# EAGLE design 4robots_MAIN_1_1 (EAGLE 9.5.0)
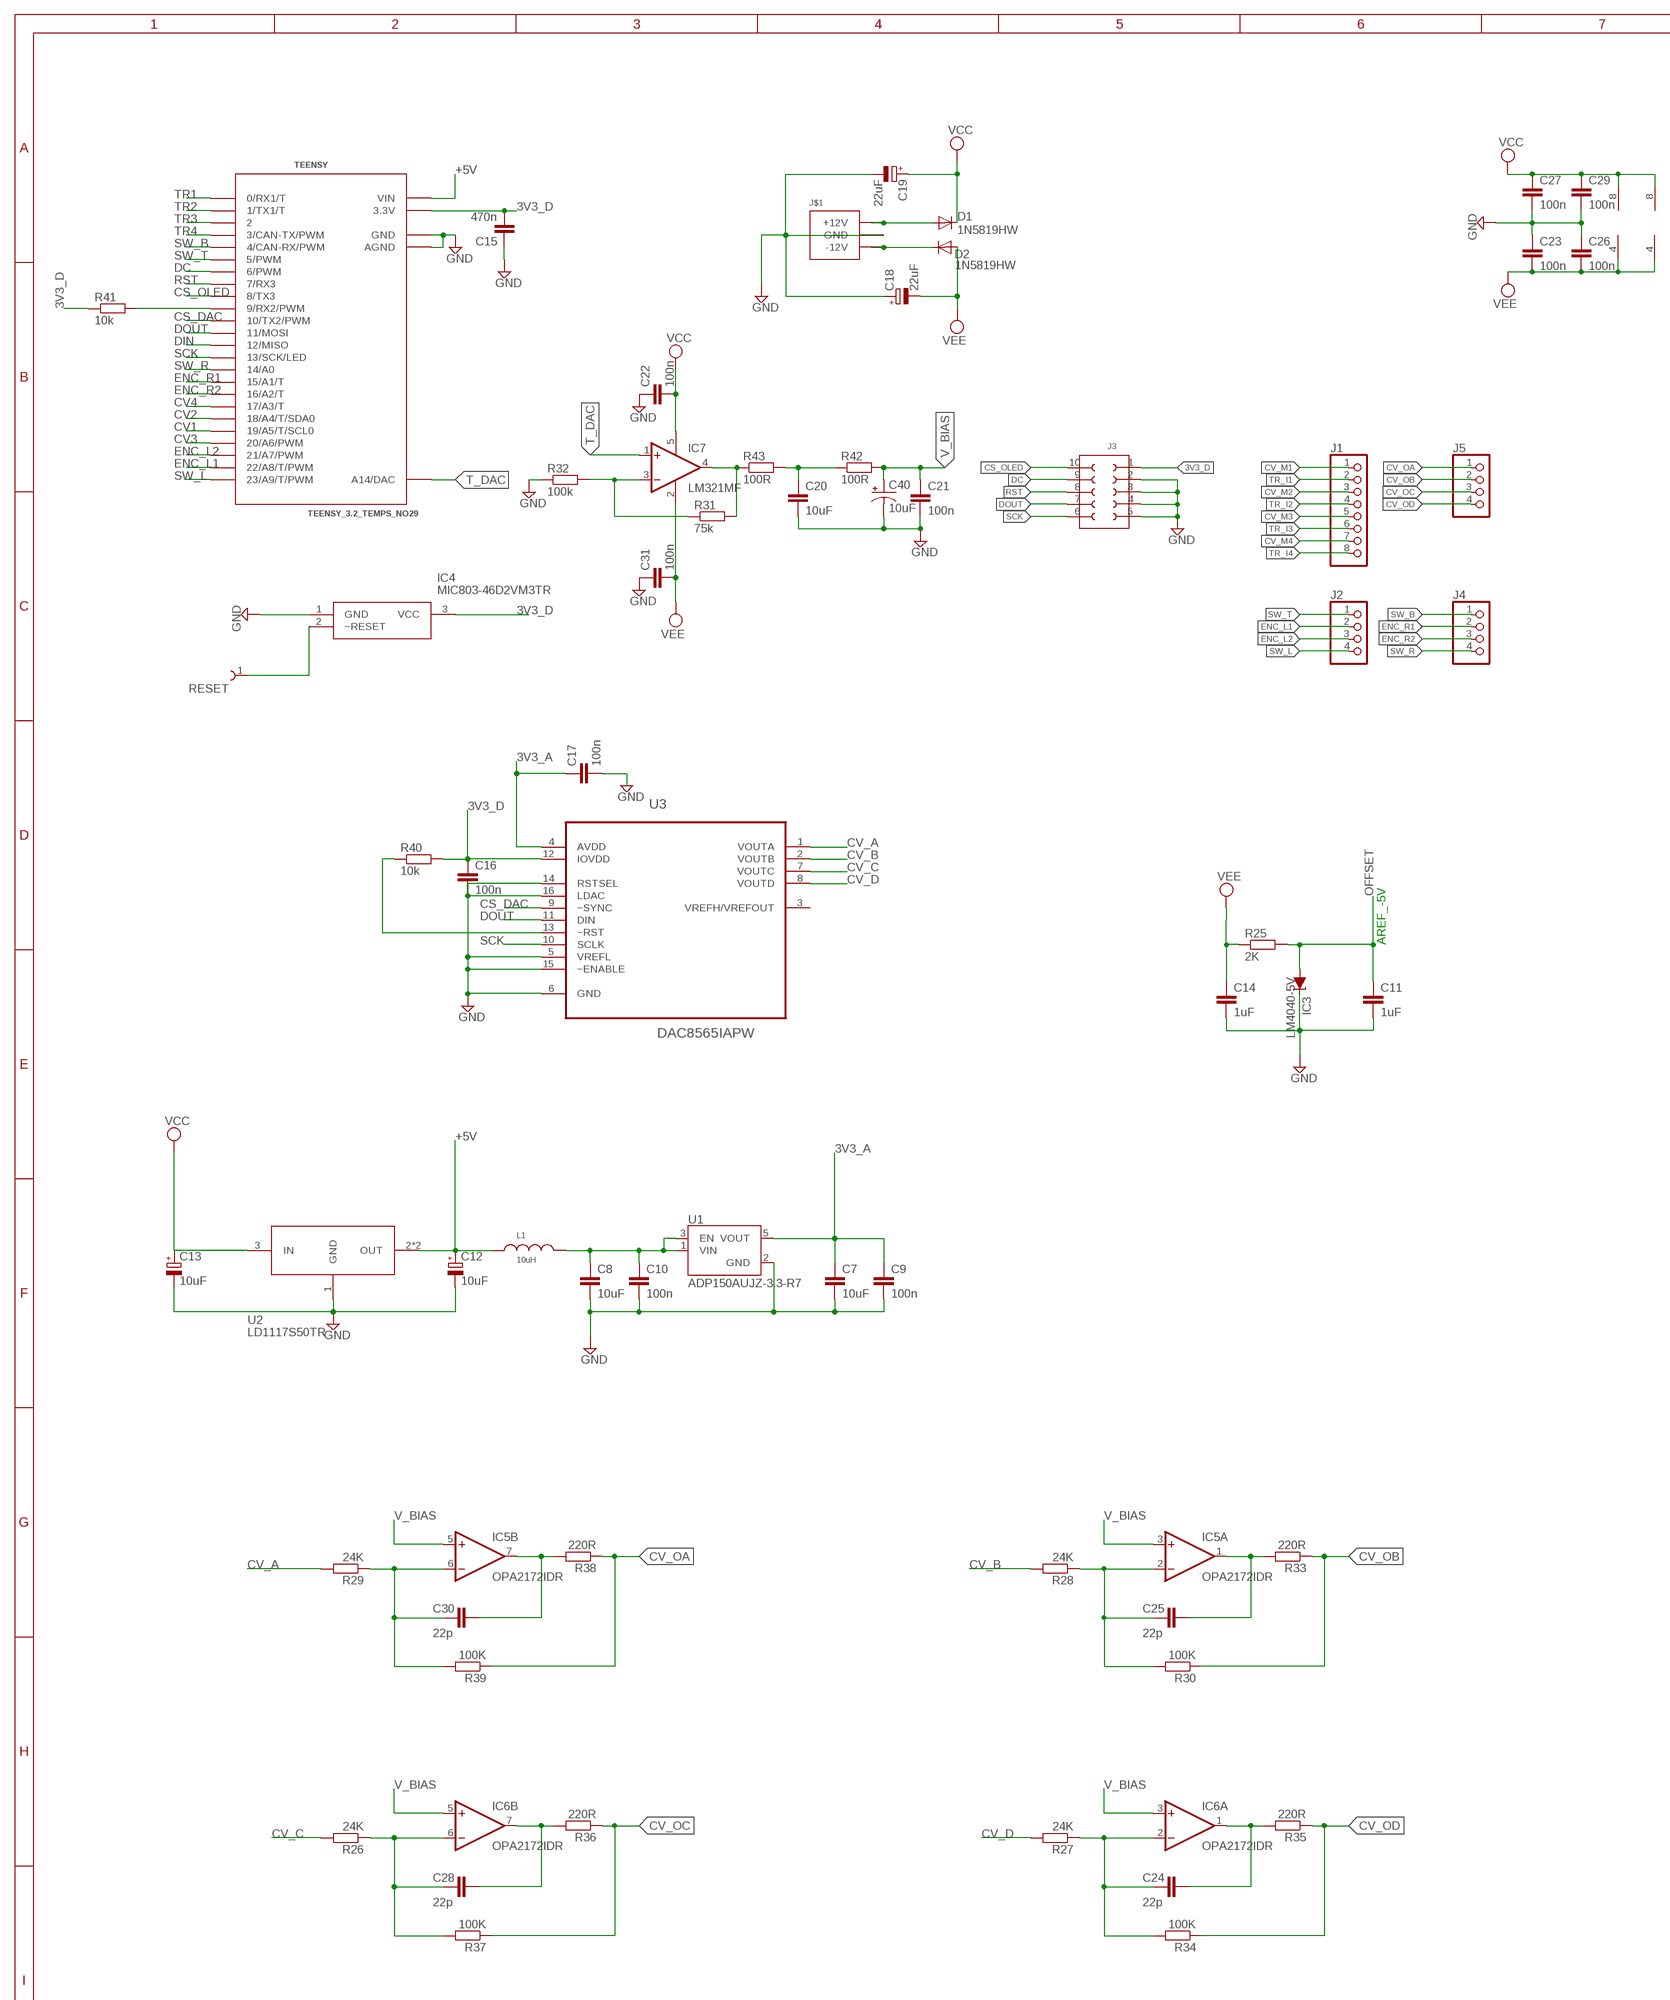
[diagram p0: schematic, sheet 1, part 1 of 2]
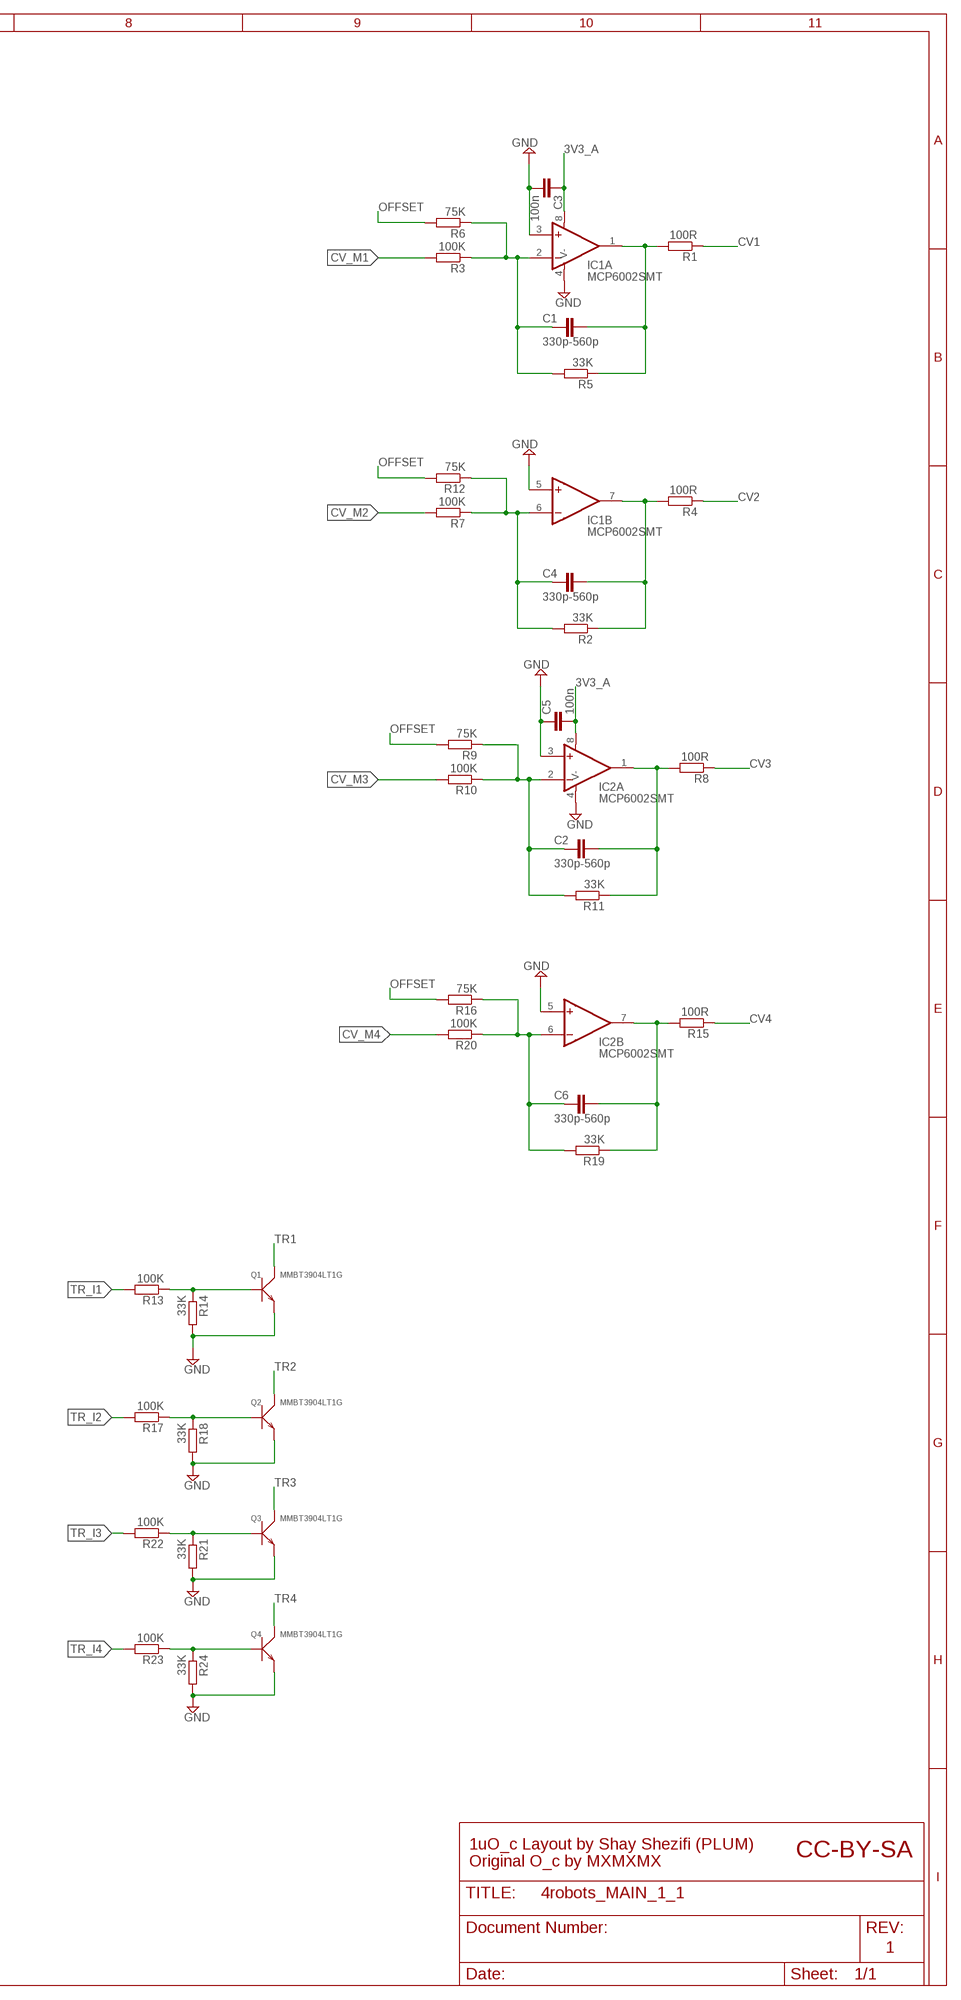
[diagram p1: schematic, sheet 1, part 2 of 2]

## Parts
C1  330p-560p  C-EUC0603  [C0603]
C2  330p-560p  C-EUC0603  [C0603]
C3  100n  C-EUC0603  [C0603]
C4  330p-560p  C-EUC0603  [C0603]
C5  100n  C-EUC0603  [C0603]
C6  330p-560p  C-EUC0603  [C0603]
C7  10uF  C-EUC1206K  [C1206K]
C8  10uF  C-EUC1206K  [C1206K]
C9  100n  C-EUC0603  [C0603]
C10  100n  C-EUC0603  [C0603]
C11  1uF  C-EUC0603  [C0603]
C12  10uF  CPOL-EUB  [PANASONIC_B]
C13  10uF  CPOL-EUB  [PANASONIC_B]
C14  1uF  C-EUC0603  [C0603]
C15  470n  C-EUC0603  [C0603]
C16  100n  C-EUC0603  [C0603]
C17  100n  C-EUC0603  [C0603]
C18  22uF  CPOL-EUC  [PANASONIC_C]
C19  22uF  CPOL-EUC  [PANASONIC_C]
C20  10uF  C-EUC0603  [C0603]
C21  100n  C-EUC0603  [C0603]
C22  100n  C-EUC0603  [C0603]
C23  100n  C-EUC0603  [C0603]
C24  22p  C-EUC0603  [C0603]
C25  22p  C-EUC0603  [C0603]
C26  100n  C-EUC0603  [C0603]
C27  100n  C-EUC0603  [C0603]
C28  22p  C-EUC0603  [C0603]
C29  100n  C-EUC0603  [C0603]
C30  22p  C-EUC0603  [C0603]
C31  100n  C-EUC0603  [C0603]
C40  10uF  CPOL-USA  [PANASONIC_A]
D1  1N5819HW  DIODE_DIODE-SOD123  [DIODE_SOD123]
D2  1N5819HW  DIODE_DIODE-SOD123  [DIODE_SOD123]
IC1  MCP6002SMT  [SOIC8]
IC2  MCP6002SMT  [SOIC8]
IC3  LM4040-5V  LM4041B12DBZ  [DBZ_R-PDSO-G3]
IC4  MIC803-46D2VM3TR  [SOT95P230X110-3N]
IC5  OPA2172IDR  TL072D  [SO08]
IC6  OPA2172IDR  TL072D  [SO08]
IC7  LM321MF  [SOT23-5]
J1  PINHD-1X8  [1X08]
J2  PINHD-1X4  [1X04]
J3  61301021121  [61301021121]
J4  PINHD-1X4  [1X04]
J5  PINHD-1X4  [1X04]
J$1  POWER_SIMPLE10  [POWER_10]
L1  10uH  WE-LQ_1210_744032001  [WE-LQ_M]
Q1  MMBT3904LT1G  SMD-TRANSISTORS-NPN-40V-200MA-MMBT3904LT1G(SOT-23)  [SOT-23]
Q2  MMBT3904LT1G  SMD-TRANSISTORS-NPN-40V-200MA-MMBT3904LT1G(SOT-23)  [SOT-23]
Q3  MMBT3904LT1G  SMD-TRANSISTORS-NPN-40V-200MA-MMBT3904LT1G(SOT-23)  [SOT-23]
Q4  MMBT3904LT1G  SMD-TRANSISTORS-NPN-40V-200MA-MMBT3904LT1G(SOT-23)  [SOT-23]
R1  100R  R-EU_R0603  [R0603]
R2  33K  R-EU_R0603  [R0603]
R3  100K  R-EU_R0603  [R0603]
R4  100R  R-EU_R0603  [R0603]
R5  33K  R-EU_R0603  [R0603]
R6  75K  R-EU_R0603  [R0603]
R7  100K  R-EU_R0603  [R0603]
R8  100R  R-EU_R0603  [R0603]
R9  75K  R-EU_R0603  [R0603]
R10  100K  R-EU_R0603  [R0603]
R11  33K  R-EU_R0603  [R0603]
R12  75K  R-EU_R0603  [R0603]
R13  100K  R-EU_R0603  [R0603]
R14  33K  R-EU_R0603  [R0603]
R15  100R  R-EU_R0603  [R0603]
R16  75K  R-EU_R0603  [R0603]
R17  100K  R-EU_R0603  [R0603]
R18  33K  R-EU_R0603  [R0603]
R19  33K  R-EU_R0603  [R0603]
R20  100K  R-EU_R0603  [R0603]
R21  33K  R-EU_R0603  [R0603]
R22  100K  R-EU_R0603  [R0603]
R23  100K  R-EU_R0603  [R0603]
R24  33K  R-EU_R0603  [R0603]
R25  2K  R-EU_R0603  [R0603]
R26  24K  R-EU_R0603  [R0603]
R27  24K  R-EU_R0603  [R0603]
R28  24K  R-EU_R0603  [R0603]
R29  24K  R-EU_R0603  [R0603]
R30  100K  R-EU_R0603  [R0603]
R31  75k  R-EU_R0603  [R0603]
R32  100k  R-EU_R0603  [R0603]
R33  220R  R-EU_R0603  [R0603]
R34  100K  R-EU_R0603  [R0603]
R35  220R  R-EU_R0603  [R0603]
R36  220R  R-EU_R0603  [R0603]
R37  100K  R-EU_R0603  [R0603]
R38  220R  R-EU_R0603  [R0603]
R39  100K  R-EU_R0603  [R0603]
R40  10k  R-EU_R0603  [R0603]
R41  10k  R-EU_R0603  [R0603]
R42  100R  R-EU_R0603  [R0603]
R43  100R  R-EU_R0603  [R0603]
RESET  61300111121  [61300111121]
TEENSY  TEENSY_3.2_TEMPS_NO29  [TEENSY_3.2_TEMPS_NO29]
U1  ADP150AUJZ-3.3-R7  [SOT95P280X100-5N]
U2  LD1117S50TR  [SOT223]
U3  DAC8565IAPW  [SOP65P640X120-16N]

## Nets
3V3_A: C3.1 C5.2 C7.1 C9.1 C17.1 IC1.8(A:V+) IC2.8(A:V+) U1.5(VOUT) U3.4(AVDD)
3V3_D: C15.2 C16.1 IC4.3(VCC) J3.1 R40.2 R41.1 TEENSY.3.3V U3.12(IOVDD)
+5V: C12.+ L1.1 TEENSY.VIN U2.2(OUT) U2.4(OUT)
CS_DAC: TEENSY.10(10/TX2/PWM) U3.9(~SYNC)
CS_OLED: J3.10 TEENSY.8(8/TX3)
CV1: R1.1 TEENSY.19/A5(19/A5/T/SCL0)
CV2: R4.1 TEENSY.18/A4(18/A4/T/SDA0)
CV3: R8.1 TEENSY.20/A6(20/A6/PWM)
CV4: R15.1 TEENSY.17/A3(17/A3/T)
CV_A: R29.2 U3.1(VOUTA)
CV_B: R28.2 U3.2(VOUTB)
CV_C: R26.2 U3.7(VOUTC)
CV_D: R27.2 U3.8(VOUTD)
CV_M1: J1.1 R3.2
CV_M2: J1.3 R7.2
CV_M3: J1.5 R10.2
CV_M4: J1.7 R20.2
CV_OA: J5.1 R38.1 R39.1
CV_OB: J5.2 R30.1 R33.1
CV_OC: J5.3 R36.1 R37.1
CV_OD: J5.4 R34.1 R35.1
DC: J3.9 TEENSY.6(6/PWM)
DIN: TEENSY.12(12/MISO)
DOUT: J3.7 TEENSY.11(11/MOSI) U3.11(DIN)
ENC_L1: J2.2 TEENSY.22/A8(22/A8/T/PWM)
ENC_L2: J2.3 TEENSY.21/A7(21/A7/PWM)
ENC_R1: J4.2 TEENSY.15/A1(15/A1/T)
ENC_R2: J4.3 TEENSY.16/A2(16/A2/T)
GND: C3.2 C5.1 C7.2 C8.2 C9.2 C10.2 C11.2 C12.- C13.- C14.2 C15.1 C16.2 C17.2 C18.+ C19.- C20.2 C21.2 C22.1 C23.1 C26.1 C27.2 C29.2 C31.1 C40.- IC1.3(A:+IN) IC1.4(A:V-) IC1.5(B:+IN) IC2.3(A:+IN) IC2.4(A:V-) IC2.5(B:+IN) IC3.1(C) IC4.1(GND) J3.2 J3.3 J3.4 J3.5 J$1.3(GND) J$1.4(GND) J$1.5(GND) J$1.6(GND) J$1.7(GND) J$1.8(GND) Q1.2(E) Q2.2(E) Q3.2(E) Q4.2(E) R14.2 R18.2 R21.2 R24.2 R32.1 TEENSY.AGND TEENSY.GND U1.2(GND) U2.1(GND) U3.5(VREFL) U3.6(GND) U3.14(RSTSEL) U3.15(~ENABLE) U3.16(LDAC)
N$1: D2.C J$1.1(-12V) J$1.2(-12V)
N$2: D1.A J$1.9(+12V) J$1.10(+12V)
N$3: C8.1 C10.1 L1.2 U1.1(VIN) U1.3(EN)
N$4: IC7.4(OUT) R31.2 R43.1
N$5: C1.2 IC1.2(A:-IN) R3.1 R5.2 R6.1
N$6: C1.1 IC1.1(A:OUT) R1.2 R5.1
N$7: IC7.3(-IN) R31.1 R32.2
N$8: R40.1 U3.13(~RST)
N$9: R41.2 TEENSY.9(9/RX2/PWM)
N$10: C4.2 IC1.6(B:-IN) R2.2 R7.1 R12.1
N$11: C4.1 IC1.7(B:OUT) R2.1 R4.2
N$12: C20.1 R42.1 R43.2
N$13: C2.2 IC2.2(A:-IN) R9.1 R10.1 R11.2
N$14: C2.1 IC2.1(A:OUT) R8.2 R11.1
N$16: C6.2 IC2.6(B:-IN) R16.1 R19.2 R20.1
N$17: C6.1 IC2.7(B:OUT) R15.2 R19.1
N$19: Q1.1(B) R13.1 R14.1
N$21: Q2.1(B) R17.1 R18.1
N$23: Q3.1(B) R21.1 R22.1
N$25: Q4.1(B) R23.1 R24.1
N$26: C25.2 IC5.2(A:-IN) R28.1 R30.2
N$27: C30.2 IC5.6(B:-IN) R29.1 R39.2
N$28: C30.1 IC5.7(B:OUT) R38.2
N$30: C25.1 IC5.1(A:OUT) R33.2
N$32: C28.2 IC6.6(B:-IN) R26.1 R37.2
N$33: C28.1 IC6.7(B:OUT) R36.2
N$35: C24.2 IC6.2(A:-IN) R27.1 R34.2
N$36: C24.1 IC6.1(A:OUT) R35.2
N$52: IC4.2(~RESET) RESET.1
OFFSET: C11.1 IC3.2(A) R6.2 R9.2 R12.2 R16.2 R25.2
RST: J3.8 TEENSY.7(7/RX3)
SCK: J3.6 TEENSY.13(13/SCK/LED) U3.10(SCLK)
SW_B: J4.1 TEENSY.4(4/CAN-RX/PWM)
SW_L: J2.4 TEENSY.23/A9(23/A9/T/PWM)
SW_R: J4.4 TEENSY.14/A0
SW_T: J2.1 TEENSY.5(5/PWM)
T_DAC: IC7.1(+IN) TEENSY.RESET/DAC(A14/DAC)
TR1: Q1.3(C) TEENSY.0(0/RX1/T)
TR2: Q2.3(C) TEENSY.1(1/TX1/T)
TR3: Q3.3(C) TEENSY.2
TR4: Q4.3(C) TEENSY.3(3/CAN-TX/PWM)
TR_I1: J1.2 R13.2
TR_I2: J1.4 R17.2
TR_I3: J1.6 R22.2
TR_I4: J1.8 R23.2
V_BIAS: C21.1 C40.+ IC5.3(A:+IN) IC5.5(B:+IN) IC6.3(A:+IN) IC6.5(B:+IN) R42.2
VCC: C13.+ C19.+ C22.2 C27.1 C29.1 D1.C IC5.8(P:V+) IC6.8(P:V+) IC7.5(V+) U2.3(IN)
VEE: C14.1 C18.- C23.2 C26.2 C31.2 D2.A IC5.4(P:V-) IC6.4(P:V-) IC7.2(V-) R25.1
Unconnected: U3.3(VREFH/VREFOUT)

## Notes on the sheet
- AREF_-5V
- CC-BY-SA
- 1uO_c Layout by Shay Shezifi (PLUM)
  Original O_c by MXMXMX
- 1

## Library data of the parts
C1-C11 C14-C17 C20-C31 = resistor:C-EU: CAPACITOR, European symbol
C12 C13 C18 C19 = rcl:CPOL-EU: POLARIZED CAPACITOR, European symbol; SPICEPREFIX: C
C40 = rcl:CPOL-US: POLARIZED CAPACITOR, American symbol
D1 D2 = elements_v02:DIODE_DIODE-: DIODE
IC1 IC2 = EurorackModularParts:MCP6002: Dual General Op Amp 1.8V min supply 1MHz (6V/us)
IC3 = texas:LM4041: PRECISION MICROPOWER SHUNT VOLTAGE REFERENCE Source: http://focus.ti.com/lit/ds/slcs146e/slcs146e.pdf
IC4 = MIC803-46D2VM3TR:MIC803-46D2VM3TR: 3-pin Microprocessor Supervosor Circui Source: Datasheet; ARROW_PART_NUMBER: MIC803-46D2VM3TR; DESCRIPTION: 3-pin Microprocessor Supervosor Circui; HEIGHT: mm; MANUFACTURER_NAME: Micrel; MANUFACTURER_PART_NUMBER: MIC803-46D2VM3TR
IC5 IC6 = linear:TL072: OP AMP
IC7 = linear:LM321?*: Low Power Single Op Amp Source: http://cache.national.com/ds/LM/LM321.pdf
J1 = pinhead:PINHD-1X8: PIN HEADER
J2 J4 J5 = pinhead:PINHD-1X4: PIN HEADER
J3 = Wurth_Elektronik_Electromechanic_Board_to_Board_Connectors_rev17a:61301021121: WR-PHD 2.54mm Dual Pin Header, 10 Pins =>Code : Con_BTB_PHD_2.54_2_61301021121 <http://katalog.we-online.de/media/images/eican/Con_BTB_PHD_2.54_2_6130xx21121_pf2.jpg> Details see: http://katalog.we-online.de/en/em/613_0xx_211_21 Created 2014-05-29, Karrer Zheng 2014 (C) Würth Elektronik
J$1 = EurorackModularParts:POWER_SIMPLE
L1 = Wurth_Elektronik_Passive_rev17b:WE-LQ_1210: SMD Inductor Characteristics Miniature chip inductor wound on a special ferrite core Small inductances for compact circuits High Q at high frequencies Low DC-resistance Operating temperature: –40 ºC to +125 ºC Applications Low power DC/DC-converters from Linear Technology, National Semiconductor, Texas Instruments, Fairchild Semiconductor, ON Semiconductor, STMicroelectronics, Maxim, MPS, Semtech, Exar, Analogic Tech, Diodes and Cologne Chip EMI-Filtering RF-circuits <http://katalog.we-online.de/media/images/eisos/IndLQ_pf2.jpg> Details see: http://katalog.we-online.de/en/pbs/WE-LQ? Updated by Dan Xu 2014-07-08 2014 (C) Wurth Elektronik; WE-NUMBER: 744032001/1uH
Q1-Q4 = Seeed-Transistor:SMD-TRANSISTORS-NPN-40V-200MA-MMBT3904LT1G(SOT-23): 305010013; MPN: MMBT3904LT1G
R1-R43 = rcl:R-EU_: RESISTOR, European symbol; SPICEPREFIX: R
RESET = Wurth_Elektronik_Electromechanic_Board_to_Board_Connectors_rev17a:61300111121: WR-PHD 2.54 mm Pin Header, 1Pin=>Code : Con_BTB_PHD_2.54_1_THT_61300111121 <http://katalog.we-online.de/media/images/eican/Con_BTB_PHD_2.54_1_THT_6130xx11121_pf2.jpg> Details see: http://katalog.we-online.de/en/em/613_0xx_111_21 Created 2014-05-29, Karrer Zheng 2014 (C) Würth Elektronik
TEENSY = Teensy_3_and_LC_Series_Boards_v1.4:TEENSY_3.2_TEMPS_NO29
U1 = ADP150AUJZ-2.3-R7:ADP150AUJZ-3.3-R7: IC REG LINEAR 2V 150MA 5TSOT; AVAILABILITY: Good; DESCRIPTION: LDO Regulator Pos 2V 0.15A 5-Pin TSOT T/R; MF: Analog Devices; MP: ADP150AUJZ-2.0-R7; PACKAGE: TSOT-23 Analog Devices; PRICE: 0.65 USD
U2 = LD1117S50TR:LD1117S50TR: http://octopart.com/ld1117s50tr-stmicroelectronics-529395; AVAILABILITY: Good; DESCRIPTION: LD1117 Series 1300 mA 5 V Fixed Output Positive Voltage LDO Regulator - SOT-223; MF: STMicroelectronics; MP: LD1117S50TR; PACKAGE: SOT-223 STMicroelectronics; PRICE: 0.19 USD
U3 = DAC8565IAPW:DAC8565IAPW: Quad Channel DAC; AVAILABILITY: Good; DESCRIPTION: 16-Bit, Quad Channel, Ultra-Low Glitch, Voltage Output DAC with 2.5V, 2ppm/C Internal eference 16-TSSOP -40 to 105; MF: Texas Instruments; MP: DAC8565IAPW; PACKAGE: TSSOP-16 Texas Instruments; PRICE: 10.78 USD

## Board
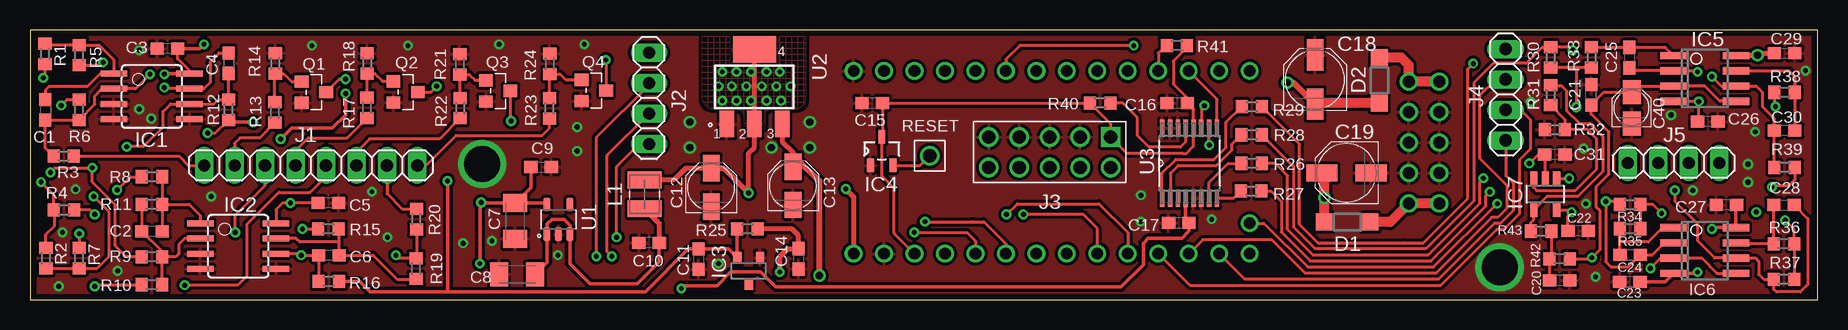
[diagram p2: board, top side]
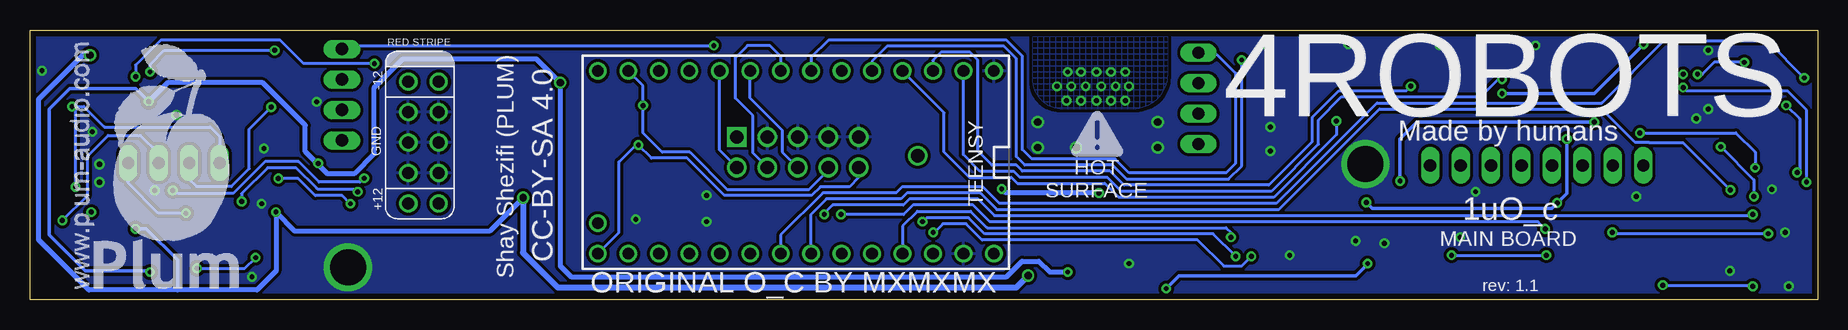
[diagram p3: board, bottom side, seen from below]

Size 149 x 22.5 mm. Coordinates in mm from the lower left corner, seen from the top.
Outline: 0,0 149,0 149,22.5 0,22.5 0,0
Copper layers (1*16): Top 0.035mm / dielectric 1.5mm / Bottom 0.035mm
Design rules "default *": minimum track width 6mil, minimum drill 0.4mm, track to track 10mil, track to pad 10mil, pad to pad 10mil, via to via 10mil, smd to smd 7mil, copper to edge 20mil, drill to drill 8mil, minimum pad ring 10mil, minimum via ring 8mil, stop-mask expansion 10mil, vias tented up to drill 25mil, thermal gap 10mil

### Footprints (pad centres in the part's own frame; a part is rotated, then mirrored left to right if it is on the bottom)
C0603 = smd 1.1 x 1: 1 -0.85,0; 2 0.85,0
C1206K = smd 1.5 x 2: 1 -1.5,0; 2 1.5,0
PANASONIC_B = smd 2.2 x 1.4: + 1.6,0; - -1.6,0
PANASONIC_C = smd 2.6 x 1.4: + 2.05,0; - -2.05,0
PANASONIC_A = smd 2 x 1.5: + 1.3,0; - -1.3,0
DIODE_SOD123 = smd 1.4 x 1.4: A 1.9,0; C -1.9,0
SOIC8 = smd 0.5 x 2.2: 1 -1.905,-3.154; 2 -0.645,-3.154; 3 0.625,-3.154; 4 1.895,-3.154; 5 1.905,3.154; 6 0.635,3.154; 7 -0.635,3.154; 8 -1.905,3.154
DBZ_R-PDSO-G3 = smd 0.7 x 1: 1 -0.95,-1.1; 2 0.95,-1.1; 3 0,1.1
SOT95P230X110-3N = smd 1.118 x 0.559: 1 -1.194,0.94; 2 -1.194,-0.94; 3 1.194,0
SO08 = smd 0.6 x 2.2: 1 -1.905,-2.6; 2 -0.635,-2.6; 3 0.635,-2.6; 4 1.905,-2.6; 5 1.905,2.6; 6 0.635,2.6; 7 -0.635,2.6; 8 -1.905,2.6
SOT23-5 = smd 0.6 x 1.2: 1 -0.95,-1.306; 2 0,-1.306; 3 0.95,-1.306; 4 0.95,1.306; 5 -0.95,1.306
1X08 = drill 1.016 long: 1 -8.89,0; 2 -6.35,0; 3 -3.81,0; 4 -1.27,0; 5 1.27,0; 6 3.81,0; 7 6.35,0; 8 8.89,0
1X04 = drill 1.016 long: 1 -3.81,0; 2 -1.27,0; 3 1.27,0; 4 3.81,0
61301021121 = drill 1.1 square: 1 -5.08,-1.27 | drill 1.1: 2 -2.54,-1.27; 3 0,-1.27; 4 2.54,-1.27; 5 5.08,-1.27; 6 5.08,1.27; 7 2.54,1.27; 8 0,1.27; 9 -2.54,1.27; 10 -5.08,1.27
POWER_10 = drill 1.016: 1 -5.08,-1.27; 2 -5.08,1.27; 3 -2.54,-1.27; 4 -2.54,1.27; 5 0,-1.27; 6 0,1.27; 7 2.54,-1.27; 8 2.54,1.27; 9 5.08,-1.27; 10 5.08,1.27
WE-LQ_M = smd 1.4 x 2.8: 1 -1.2,0; 2 1.2,0
SOT-23 = smd 1.016 x 1.143: 1 -0.889,-1.016; 2 0.889,-1.016; 3 0,1.016
R0603 = smd 1 x 1.1: 1 -0.85,0; 2 0.85,0
61300111121 = drill 1.1: 1 0,0
TEENSY_3.2_TEMPS_NO29 = drill 0.965: 0 -7.62,13.97; 1 -7.62,11.43; 2 -7.62,8.89; 3 -7.62,6.35; 3.3V 7.62,11.43; 4 -7.62,3.81; 5 -7.62,1.27; 6 -7.62,-1.27; 7 -7.62,-3.81; 8 -7.62,-6.35; 9 -7.62,-8.89; 10 -7.62,-11.43; 11 -7.62,-13.97; 12 -7.62,-16.51; 13 7.62,-16.51; 14/A0 7.62,-13.97; 15/A1 7.62,-11.43; 16/A2 7.62,-8.89; 17/A3 7.62,-6.35; 18/A4 7.62,-3.81; 19/A5 7.62,-1.27; 20/A6 7.62,1.27; 21/A7 7.62,3.81; 22/A8 7.62,6.35; 23/A9 7.62,8.89; AGND 7.62,13.97; GND -7.62,16.51; RESET/DAC 5.08,-16.51; VIN 7.62,16.51
SOT95P280X100-5N = smd 1.14 x 0.59: 1 -1.245,0.95; 2 -1.245,0; 3 -1.245,-0.95; 4 1.245,-0.95; 5 1.245,0.95
SOT223 = smd 2.235 x 1.219: 1 -3.099,2.311; 2 -3.099,0; 3 -3.099,-2.311 | smd 2.2 x 3.6: 4 3.099,0
SOP65P640X120-16N = smd 1.473 x 0.356: 1 -2.921,2.286; 2 -2.921,1.626; 3 -2.921,0.965; 4 -2.921,0.33; 5 -2.921,-0.33; 6 -2.921,-0.965; 7 -2.921,-1.626; 8 -2.921,-2.286; 9 2.921,-2.286; 10 2.921,-1.626; 11 2.921,-0.965; 12 2.921,-0.33; 13 2.921,0.33; 14 2.921,0.965; 15 2.921,1.626; 16 2.921,2.286

### Placement (x,y rotation side)
C1  1.28,15.83 270 top
C2  10.17,5.7 180 top
C3  11.45,20.95 180 top
C4  16.55,19.72 270 top
C5  24.87,8.06 180 top
C6  24.91,3.7 180 top
C7  40.45,6.55 270 top
C8  40.6,2.1 180 top
C9  42.6,11.05 0 top
C10  51.6,4.75 180 top
C11  55.72,3.37 270 top
C12  56.79,9.35 90 top
C13  63.61,9.5 90 top
C14  64.05,3.4 270 top
C15  70.2,16.41 0 top
C16  95.62,16.39 180 top
C17  95.76,6.39 180 top
C18  107.12,18.36 90 top
C19  109.74,10.57 180 top
C20  127.51,1.62 0 top
C21  130.14,17.09 90 top
C22  129.05,5.73 180 top
C23  133.35,1.5 0 top
C24  133.39,3.75 0 top
C25  133.3,20.19 270 top
C26  139.85,14.85 180 top
C27  141.4,7.9 180 top
C28  146.2,7.9 0 top
C29  146.25,20.55 0 top
C30  146.25,14.1 180 top
C31  127.1,12.1 180 top
C40  133.5,16 90 top
D1  109.8,6.47 0 top
D2  112.47,18.29 270 top
IC1  10.15,16.95 270 top
IC2  17.35,4.45 270 top
IC3  59.9,2.4 180 top
IC4  71,12.4 90 top
IC5  139.6,18.45 270 top
IC6  139.6,4.1 270 top
IC7  126.3,8.8 180 top
J1  23.4,11.2 0 top
J2  51.6,16.8 270 top
J3  85,12.3 180 top
J4  123,17.1 270 top
J5  137,11.4 0 top
J$1  116.2,13.1 270 bottom
L1  51.23,8.78 270 top
Q1  23.67,17.3 270 top
Q2  31.31,17.32 270 top
Q3  39.02,17.41 270 top
Q4  47,17.45 270 top
R1  1.25,20.5 90 top
R2  1.33,3.45 270 top
R3  2.81,11.97 0 top
R4  2.84,7.48 180 top
R5  4.1,20.4 270 top
R6  4.1,15.85 90 top
R7  4.1,3.46 90 top
R8  10.15,10.25 0 top
R9  10.15,3.57 180 top
R10  10.15,1.25 180 top
R11  10.16,7.95 180 top
R12  16.55,15.85 270 top
R13  20.41,15.61 270 top
R14  20.45,19.7 90 top
R15  24.89,5.9 0 top
R16  24.91,1.52 0 top
R17  28.09,16.01 270 top
R18  28.11,19.72 90 top
R19  32.18,2.6 90 top
R20  32.22,6.71 90 top
R21  35.83,19.64 90 top
R22  35.86,15.98 270 top
R23  43.31,15.96 270 top
R24  43.33,19.68 90 top
R25  59.8,5.9 180 top
R26  101.83,11.37 180 top
R27  101.79,9.06 180 top
R28  101.84,13.75 180 top
R29  101.85,16.1 180 top
R30  126.75,20.2 90 top
R31  126.75,17.06 90 top
R32  127.1,14.18 0 top
R33  130.15,20.2 90 top
R34  133.39,7.93 180 top
R35  133.39,5.92 180 top
R36  146.2,4.65 180 top
R37  146.2,1.7 180 top
R38  146.25,17.3 0 top
R39  146.26,11.03 180 top
R40  89.2,16.4 180 top
R41  95.6,21.2 180 top
R42  127.5,3.4 0 top
R43  125.95,5.71 0 top
RESET  75,12 0 top
TEENSY  85.16,11.45 270 bottom
U1  44.05,6.7 90 top
U2  60.39,17.76 90 top
U3  96.66,11.38 90 top

### Tracks (layer width: path | path; a pad name or v marks a point on that pad's centre or on a via)
3V3_A  (via drill 0.4)
  Top 0.254: C5.2 v21.7,8.06 21.06,8.06 20.5,7.5 IC2.8 | IC1.8 13.3,19.1 12.3,20.1 C3.1
  Top 0.305: C7.1 42.99,8.05 U1.5 | C9.1 41.75,9.35 C7.1 | U3.4 96.33,6.67 C17.1 96.61,5.71 96,5.1 93.2,5.1 92.8,4.7 92.8,2.9 90.95,1.05 62.15,1.05 60.9,2.3 58.4,2.3 57.25,1.15 54.54,1.15 v54.3,0.91 | IC1.8 11.26,18.86 v11.2,18.8 | v20.9,13.4 21.8,14.3 25.2,14.3 26.3,15.4 v26.3,17.2 | C3.1 14.15,20.95 v14.5,21.3 | C7.1 37.65,8.05 v37.6,8.1 37.5,8 v37.5,3
  Bottom 0.305: v37.5,3 38.5,2 53.21,2 v54.3,0.91 | v37.6,8.1 37.1,7.6 22.16,7.6 v21.7,8.06 20.9,8.86 v20.9,13.4 | v26.3,17.2 18.6,17.2 v14.5,21.3
3V3_D
  Top 0.254: 71.02,13.57 IC4.3 | 71.02,13.57 71.05,13.6 C15.2 R40.2 90.08,14.67 J3.1 91.44,12.21 95.69,12.21 96.09,12.21 96.4,12.21 96.99,12.8 U3.12 96.99,15.87 96.58,16.28 C16.1 96.47,16.83 95.3,18 95.3,19.9 96.45,21.05 R41.1 | 71.02,13.57 71,13.55 71,10.3 72.03,9.27 72.03,5.53 TEENSY.3.3V
+5V  (via drill 0.4)
  Top 0.406: U2.4 U2.2 60.39,12.7 59.9,12.21 v59.9,8.9 57.85,10.95 C12.+ 54.65,10.95 53.68,9.98 L1.1 | v68,9.23 68.42,8.82 68.65,8.58 TEENSY.VIN
  Bottom 0.406: v59.9,8.9 67.67,8.9 v68,9.23
  other vias: 57.7,19 58.9,19 60.1,19 61.4,19 62.5,19 63.4,17.8 62.2,17.8 61,17.8 59.7,17.8 58.5,17.8 57.4,17.8 57.7,16.6 58.9,16.6 60.1,16.6 61.4,16.6 62.6,16.6
  pour Bottom (hatched): 54.2,22.5 54.2,18.8 arc90 57.1,15.9 62.9,15.9 arc90 65.4,18.4 65.4,22.5
  pour Top (hatched): 56,22.4 56,17 arc90 57.1,15.9 59,15.9 arc-90 59.5,15.4 59.5,14.8 arc90 60.45,13.85 arc90 61.3,14.7 61.3,15.6 arc-90 61.6,15.9 63.7,15.9 arc90 64.7,16.9 64.7,22.4
CS_DAC
  Top 0.254: U3.9 98.95,16.71 TEENSY.10
CS_OLED
  Bottom 0.254: J3.10 91.51,12.46 TEENSY.8
CV1  (via drill 0.4)
  Top 0.254: v1.1,18.5 1.25,18.65 R1.1
  Bottom 0.254: v1.1,18.5 4.2,21.6 12.8,21.6 17.99,16.41 36.72,16.41 45.11,8.02 68.2,8.02 69.58,9.4 76.3,9.4 76.79,8.91 82.9,8.91 86.43,5.38 TEENSY.19/A5
CV2  (via drill 0.4)
  Top 0.254: v5.4,7.1 5.02,7.48 R4.1 | TEENSY.18/A4 88.97,5.93 87.8,7.1 v82.8,7.1
  Bottom 0.254: v5.4,7.1 5.49,7.01 68.62,7.01 70,8.38 75.7,8.38 76.19,7.89 82.09,7.89 82.8,7.18 v82.8,7.1
CV3  (via drill 0.4)
  Top 0.254: v7.26,9.14 8.37,10.25 R8.1
  Bottom 0.254: v7.26,9.14 11.22,13.1 14.03,13.1 14.04,13.11 15.2,13.11 18,15.9 36.51,15.9 44.9,7.52 68.41,7.52 69.79,8.89 75.91,8.89 76.4,8.4 82.61,8.4 83.89,7.12 TEENSY.20/A6
CV4  (via drill 0.4)
  Top 0.254: v22.7,5.9 R15.1 | v81.4,7.1 82.3,8 89.1,8 91.51,5.59 TEENSY.17/A3
  Bottom 0.254: v22.7,5.9 23.3,6.5 69,6.5 70.38,7.88 75.4,7.88 76.18,7.1 v81.4,7.1
CV_A
  Top 0.254: U3.1 94.37,10.57 95.5,11.7 98.7,11.7 99.7,12.7 99.7,14.8 R29.2
CV_B
  Top 0.254: U3.2 95.06,8.48 95.06,10.54 95.71,11.19 98.91,11.19 100.21,12.49 100.21,12.97 R28.2
CV_C
  Top 0.254: U3.7 98.29,9.79 99.87,11.37 R26.2
CV_D
  Top 0.254: U3.8 100.34,8.46 R27.2
CV_M1
  Top 0.254: R3.2 12.43,11.97 13.2,11.2 J1.1
CV_M2  (via drill 0.4)
  Top 0.254: v4.1,5.5 R7.2 | v17.1,5.6 17.1,7.02 19.6,9.52 J1.3
  Bottom 0.254: v4.1,5.5 17,5.5 v17.1,5.6
CV_M3  (via drill 0.4)
  Top 0.254: J1.5 24.67,10.27 23.34,8.94 20.74,8.94 18.1,6.3 18.1,2 17.3,1.2 v12.9,1.2 | v5.4,1.1 5.55,1.25 R10.2
  Bottom 0.254: v12.9,1.2 5.5,1.2 v5.4,1.1
CV_M4
  Top 0.254: J1.7 29.75,8.85 31.04,7.56 R20.2
CV_OA  (via drill 0.4)
  Top 0.254: R38.1 145.4,16.21 v145.5,16.11 | R39.1 147.11,10.01 146.6,9.5 145.3,9.5 v145.2,9.4
  Bottom 0.254: J5.1 133.2,13.6 134,14.4 142.8,14.4 144.5,16.11 v145.5,16.11 145.2,15.8 v145.2,9.4
CV_OB  (via drill 0.4)
  Top 0.254: R33.1 128.9,19.35 | 128.9,19.35 R30.1 | 128.9,19.35 v128.9,16.06
  Bottom 0.254: J5.2 135.73,10.04 135.11,9.42 132.22,9.42 130.72,10.92 130.72,14.25 v128.9,16.06
CV_OC  (via drill 0.4)
  Top 0.254: R37.1 R36.1 147.05,5.85 v146.3,6.6
  Bottom 0.254: v146.3,6.6 144.2,8.7 144.2,12 142.5,13.7 139.8,13.7 138.27,12.17 J5.3
CV_OD  (via drill 0.4)
  Top 0.254: R35.1 R34.1 135.27,7.93 v136,7.2
  Bottom 0.254: J5.4 140.81,9.71 138.3,7.2 v136,7.2
DC
  Bottom 0.254: J3.9 88.75,12.24 88.75,15.35 90.2,16.8 90.2,20.2 89.2,21.2 87.33,21.2 86.43,20.3 TEENSY.6
DOUT  (via drill 0.4)
  Top 0.254: v97.9,16.2 97.62,15.93 U3.11
  Bottom 0.254: J3.7 82.46,10.79 84.05,9.2 90.9,9.2 94,12.3 96.3,12.3 97.9,13.9 v97.9,16.2 97.9,17.84 TEENSY.11
ENC_L1  (via drill 0.4)
  Top 0.254: J2.2 51.6,17.91 47.2,13.51 v47.2,3.6 | v73.7,5.6 76.9,5.6 77.04,5.6 78.1,5.6 78.81,4.89 TEENSY.22/A8
  Bottom 0.254: v73.7,5.6 73.62,5.6 72.9,6.32 70.98,6.32 69.63,4.98 51.68,4.98 49.5,2.8 48,2.8 v47.2,3.6
ENC_L2  (via drill 0.4)
  Top 0.254: v74.6,6.5 78.5,6.5 78.68,6.5 79.5,6.5 81.35,4.65 TEENSY.21/A7 | v48.5,3.6 48.12,3.98 48.12,12.05 J2.3
  Bottom 0.254: v74.6,6.5 74.27,6.83 70.77,6.83 69.42,5.48 50.38,5.48 v48.5,3.6
ENC_R1
  Top 0.254: J4.2 122.17,18.37 120.86,17.06 120.86,11.77 122.37,10.27 123.13,9.5 123.13,7.65 122.34,6.86 121.84,6.86 117.19,2.21 106.29,2.21 103.5,5 97.76,5 TEENSY.15/A1
ENC_R2
  Top 0.254: J4.3 124.27,15.83 125.1,15 125.1,12.6 124.15,11.65 124.15,7.15 122.84,5.84 122.27,5.84 117.61,1.19 96.69,1.19 TEENSY.16/A2
GND  (via drill 0.4, 0.45, 0.6, 3)
  other vias: 57.4,3 92.6,6.5 98.5,6.7 92.6,8.7 122.5,2.7 37.7,11.3 44,3.7 38.5,4.9 9.1,15.9 10.1,15.1 9.1,20.8 61.8,12.7 65,12.7 55,14.8 55,12.7 65,14.8 129.5,12.6 125.1,16.5 136.8,15.4 143.2,11.3 143.2,9.8 130.5,1.9 129.7,8 138.6,9.1 148,19.1 143.8,14 3.8,9.2 2.7,5.6 7.3,2.4 2.4,1.1 23.5,21.2 31.5,21.2 39.1,21.3 46.2,21.3 45.6,14.4 45.6,12.4 15.1,8.6 28.5,9 29.8,5.2 36.1,4.7
  pour Top (rank 3): 0,22.6 149,22.6 149,0 0,0
  pour Bottom (rank 3): 0,22.5 149,22.5 149,0 0,0
N$1
  Top 0.813: J$1.1 J$1.2 114.93,19.57 114.3,20.2 114.29,20.19 D2.C
N$2
  Top 0.813: J$1.9 J$1.10 113.38,6.47 D1.A
N$3
  Top 0.305: C8.1 43.1,3.1 U1.1 43.1,6.3 43.5,6.7 44.5,6.7 45,6.2 U1.3 45,3 46.7,1.3 50.6,1.3 52.45,3.15 C10.1
  Top 0.406: L1.2 52.45,6.36 C10.1
N$4
  Top 0.254: R31.2 126.86,17.8 127.7,17.8 128.12,17.38 128.12,15.74 129.17,14.69 130.03,14.69 131.1,13.62 131.1,10.68 129.01,8.59 126.45,8.59 IC7.4 125.35,6.65 125.1,6.4 R43.1
N$5  (via drill 0.4)
  Top 0.254: R3.1 1.28,12.65 C1.2 4.08,14.98 R6.1 5.4,16.3 5.4,17 5.99,17.59 IC1.2 8.79,17.59 v10,18.8 | R5.2 5.85,19.55 v6.1,19.8
  Bottom 0.254: v6.1,19.8 8.61,19.8 9.6,18.8 v10,18.8
N$6
  Top 0.254: R1.2 1.35,21.25 R5.1 5.75,21.25 7,20 IC1.1 5.86,18.86 4.8,17.8 1.6,17.8 1.28,17.48 C1.1
N$7
  Top 0.254: IC7.3 125.35,9.35 125.6,9.1 128.8,9.1 130.59,10.89 130.59,13.41 129.82,14.18 R32.2 127.95,15.01 R31.1
N$8
  Top 0.254: U3.13 96.33,13.15 95.9,12.72 93.28,12.72 92.3,13.7 92.3,15.2 91.1,16.4 R40.1
N$9
  Top 0.254: R41.2 94.68,21.2 94.05,20.57 TEENSY.9
N$10  (via drill 0.4)
  Top 0.254: R2.2 R7.1 5.61,2.61 6.6,3.6 6.6,7.3 v5.3,8.6 | C4.2 R12.1 15.7,16.7 15.32,16.32 IC1.6 11.71,16.32 11.1,15.7 11.1,14.4 9.45,12.75 v8.06,12.75
  Bottom 0.254: v8.06,12.75 5.3,9.99 v5.3,8.6
N$11  (via drill 0.4)
  Top 0.254: R2.1 1.33,5.43 2,6.1 2,7.3 1.99,7.31 R4.2 1.99,8.72 v0.91,9.8 | v11.2,17.7 11.31,17.59 IC1.7 14.48,17.59 15,18.1 15,19.8 15.77,20.57 C4.1
  Bottom 0.254: v0.91,9.8 0.91,15.81 2.5,17.4 10.9,17.4 v11.2,17.7
N$12
  Top 0.254: R43.2 126.8,3.55 R42.1 C20.1
N$13
  Top 0.254: IC2.2 12.89,5.09 12.4,4.6 12.4,3.8 12.17,3.57 R9.1 | R10.1 R9.1 | R9.1 11,4.02 9.36,5.66 C2.2 R11.2
N$14
  Top 0.254: R11.1 C2.1 | R11.1 R8.2 | R11.1 13.25,7.95 14.2,7 IC2.1
N$16  (via drill 0.4)
  Top 0.254: R20.1 32.22,3.49 R19.2 30.75,3.45 v30.5,3.7 | IC2.6 22.48,3.81 v22.6,3.7 C6.2 R16.1
  Bottom 0.254: v30.5,3.7 v22.6,3.7
N$17
  Top 0.254: 25.76,4.8 C6.1 28.6,3.7 30.6,1.7 32.13,1.7 R19.1 | 25.76,4.8 25.76,5.88 R15.2 | 25.76,4.8 22.5,4.8 22.2,5.1 20.52,5.1 IC2.7
N$18  (via drill 0.4)
  other vias: 143.9,7.3
N$19
  Top 0.254: R13.1 20.41,18.81 R14.1 21.15,18.85 21.81,18.19 Q1.1
N$21
  Top 0.254: Q2.1 29.39,18.21 28.73,18.87 R18.1 28.11,16.88 R17.1
N$23
  Top 0.254: R22.1 35.86,18.76 R21.1 36.61,18.79 37.1,18.3 Q3.1
N$25
  Top 0.254: R23.1 43.33,16.83 R24.1 44.17,18.83 44.66,18.34 Q4.1
N$26  (via drill 0.4)
  Top 0.254: C25.2 133.56,19.09 IC5.2 138.91,19.09 v139,19 | v128.6,20.8 128.35,21.05 R30.2 126.05,21.05 124.71,19.71 121.97,19.71 120.36,18.1 120.36,8.24 116.35,4.24 107.13,4.24 105.32,6.05 105.32,11.12 R28.1
  Bottom 0.254: v128.6,20.8 137.8,20.8 139,19.6 v139,19
N$27  (via drill 0.4)
  Top 0.254: R39.2 C30.2 145.4,15.1 144.4,16.1 144.4,17.3 143.88,17.82 IC5.6 140.99,17.82 v140.2,18.6 | R29.1 105.83,12.97 105.83,6.26 107.34,4.75 114.6,4.75 116.14,4.75 119.85,8.46 119.85,19.25 v120.3,19.7
  Bottom 0.254: v120.3,19.7 126.2,19.7 128.16,21.66 138.1,21.66 140.2,19.57 v140.2,18.6
N$28
  Top 0.254: IC5.7 146.62,19.09 147.1,18.6 R38.2 C30.1
N$30
  Top 0.254: IC5.1 136.31,21.04 C25.1 R33.2
N$32  (via drill 0.4)
  Top 0.254: C28.2 148.2,6.75 148.2,1.26 147.57,0.64 145.56,0.64 145.35,0.85 R37.2 144.5,1.7 144.1,2.1 144.1,3.2 143.84,3.46 IC6.6 140.44,3.46 139,4.9 139,6.3 137.1,8.2 v137.1,9.1 | R26.1 103.8,11.37 104.82,10.35 104.82,5.84 106.92,3.73 116.56,3.73 120.86,8.03 120.86,9.85 v121.15,10.13
  Bottom 0.254: v121.15,10.13 121.48,9.8 124.9,9.8 126.61,11.51 129.41,11.51 132.06,8.86 136.86,8.86 v137.1,9.1
N$33
  Top 0.254: IC6.7 142.28,4.65 R36.2 C28.1
N$35  (via drill 0.4)
  Top 0.254: IC6.2 136.24,4.74 135.2,3.7 134.29,3.7 C24.2 133.19,2.7 131.8,2.7 131.35,3.15 v131.35,8.18 v131.36,8.19 132.28,8.19 R34.2 | R27.1 103.44,9.06 104.31,8.19 104.31,5.63 106.71,3.22 116.77,3.22 121.37,7.82 121.37,8.67 v121.69,8.99
  Bottom 0.254: v121.69,8.99 121.89,9.19 125,9.19 125.1,9.29 125.11,9.29 126.82,11 129.2,11 131.36,8.84 v131.36,8.19
N$36
  Top 0.254: C24.1 132.54,4.7 | 132.54,4.7 R35.2 | IC6.1 136.1,6 134.9,4.8 132.64,4.8 132.54,4.7
N$52
  Top 0.254: IC4.2 74.21,11.21 RESET.1
OFFSET  (via drill 0.4)
  Top 0.254: R9.2 8.03,3.57 7.11,4.49 7.11,7.9 5.2,9.81 v5.2,11 2.1,11 v1.7,10.6 | v2.6,16.2 3.1,16.7 R6.2 | v14.8,13.9 15.45,13.9 R12.2
  Top 0.305: R25.2 IC3.2 58.23,4.22 C11.1 54.86,4.22 51.3,0.66 34.8,0.66 | R16.2 27.48,1.52 28.34,0.66 34.8,0.66 | v18.6,14.8 16.75,14.8 R12.2 | v34.8,9.9 34.8,0.66
  Bottom 0.254: v14.8,13.9 6.8,13.9 5.2,12.3 v5.2,11 | v2.6,16.2 1.5,15.1 1.5,10.8 v1.7,10.6
  Bottom 0.305: v34.8,9.9 34.8,13.4 33.4,14.8 v18.6,14.8
RST
  Bottom 0.254: J3.8 86.3,12.33 86.3,14.13 88.97,16.8 TEENSY.7
SCK  (via drill 0.4)
  Top 0.254: v98.3,12.9 98.29,12.91 U3.10
  Bottom 0.254: J3.6 79.92,10.2 80.7,9.42 83.11,9.42 83.83,8.69 91.11,8.69 94.21,11.79 97.19,11.79 v98.3,12.9 98.5,12.9 99.9,11.5 99.9,5.6 TEENSY.13
SW_B  (via drill 0.4)
  Top 0.254: TEENSY.4 81.35,20.05 82.5,21.2 v92,21.2
  Bottom 0.254: J4.1 122.71,21.2 v92,21.2
SW_L  (via drill 0.4)
  Top 0.254: J2.4 50.79,12.99 48.9,11.1 v48.9,5.2
  Bottom 0.254: v48.9,5.2 48.9,5.6 49.29,5.99 69.21,5.99 70.59,7.37 75.03,7.37 76.27,6.13 TEENSY.23/A9
SW_R
  Top 0.254: TEENSY.14/A0 101.26,1.7 117.4,1.7 122.05,6.35 122.55,6.35 123.64,7.44 123.64,9.71 123,10.35 J4.4
SW_T
  Bottom 0.254: J2.1 50.21,20.61 48.51,18.91 48.51,11.37 49.31,10.56 57.39,10.56 58.56,11.73 65.5,11.73 66.27,12.51 66.27,20.33 67.61,21.67 82.43,21.67 83.89,20.21 TEENSY.5
T_DAC  (via drill 0.4)
  Top 0.254: TEENSY.RESET/DAC 102.85,6.37 106.5,2.72 116.98,2.72 122.27,8 v122.3,8 | IC7.1 v128.29,10.11 v128.3,10.1
  Bottom 0.254: v122.3,8 122.98,8.68 125.22,8.68 126.64,10.1 v128.3,10.1
TR1  (via drill 0.4)
  Top 0.254: Q1.3 25.79,18.4 v26.3,18.4
  Bottom 0.254: v26.3,18.4 26.6,18.4 28.08,16.92 39.68,16.92 41.6,15 41.6,12.97 45.53,9.04 58.02,9.04 59.19,10.21 66.49,10.21 66.99,10.71 69.81,10.71 71.19,12.09 TEENSY.0
TR2  (via drill 0.4)
  Top 0.254: Q2.3 33.42,17.32 v33.9,17.8
  Bottom 0.254: v33.9,17.8 34.27,17.43 39.89,17.43 42.11,15.21 42.11,13.18 45.74,9.55 57.81,9.55 58.98,10.72 66.28,10.72 66.78,11.22 68.82,11.22 70,12.4 70,20 70.65,20.65 73.05,20.65 73.73,19.97 TEENSY.1
TR3  (via drill 0.4)
  Top 0.254: Q3.3 40.04,14.96 v40.1,14.9
  Bottom 0.254: v40.1,14.9 40.1,13.75 45.32,8.53 58.23,8.53 59.4,9.7 66.7,9.7 67.2,10.2 70.7,10.2 72.8,12.3 72.8,15.6 TEENSY.2
TR4  (via drill 0.4)
  Top 0.254: v48,20 48,17.47 Q4.3
  Bottom 0.254: v48,20 48,11.16 49.1,10.06 57.6,10.06 58.77,11.22 66.07,11.22 66.78,11.94 66.78,20.12 67.82,21.16 76.5,21.16 76.72,21.16 77.54,21.16 78.81,19.89 TEENSY.3
TR_I1
  Top 0.254: R13.2 19.15,13.5 17.5,13.5 17.05,13.05 J1.2
TR_I2
  Top 0.254: J1.4 22.13,12.43 23.2,13.5 26.43,13.5 R17.2
TR_I3
  Top 0.254: R22.2 34.13,13.4 28.3,13.4 27.3,12.4 27.3,11.29 J1.6
TR_I4
  Top 0.254: J1.8 33,11.2 35.5,13.7 42.7,13.7 43.31,14.31 R23.2
V_BIAS  (via drill 0.4)
  Top 0.254: IC5.5 140.85,16.55 139.59,17.82 IC5.3 136.99,17.8 134,17.8 C40.+ 131.2,17.3 C21.1 130.14,15.47 131.61,14 131.61,10.47 130.58,9.44 130.58,7.7 130.84,7.43 130.84,4.14 v130.2,3.5 130.1,3.4 R42.2 | IC6.5 140.6,2.19 139.34,3.46 IC6.3 135.93,3.46 v135.07,2.6 | 128.6,3.15 R42.2 | R42.2 128.45,3.5
  Bottom 0.254: v135.07,2.6 131.09,2.6 v130.2,3.5
VCC  (via drill 0.4, 0.6)
  Top 0.254: IC7.5 128.31,7.49 v128.5,7.3 128.2,7 C22.2
  Top 0.305: 142.2,7.85 IC6.8 140.31,6 v140.2,5.9
  Top 0.406: 142.2,7.85 C27.1 | C29.1 144.15,20.55 v144,20.4 143.96,20.36 IC5.8 | U2.3 62.7,13.2 63.6,12.3 C13.+
  Top 0.508: v65.8,2 65.8,9.9 64.2,11.5 64.01,11.5 C13.+
  Top 0.813: D1.C v107.9,8.5 107.9,10.36 C19.+
  Bottom 0.305: 136.7,0.8 136.7,3.3 139.3,5.9 v140.2,5.9
  Bottom 0.406: v144,20.4 144.6,20.4 148.29,16.71 148.29,4.99 144.1,0.8 136.7,0.8 130.08,0.8 128.5,2.38 v128.5,7.3 126.9,5.7 110.7,5.7 v107.9,8.5
  Bottom 0.508: v107.9,8.5 107.9,3.9 105,1 66.8,1 v65.8,2
VEE  (via drill 0.4, 0.6)
  Top 0.254: IC7.2 126.3,12.05 C31.2 125.71,12.1 v124.97,11.36 | C26.2 139.1,14.95 v139.1,16.53 139.09,16.55 IC5.4
  Top 0.305: v139,2.3 138.9,2.19 IC6.4 136.31,1.5 C23.2
  Top 0.406: v62.5,2.3 62.5,3.6 63.15,4.25 C14.1 64.05,5.35 63.5,5.9 R25.1
  Top 0.508: C18.- 105.33,18.1 v104.8,18.1
  Top 0.813: D2.A 107.2,16.39 C18.-
  Bottom 0.254: v124.97,11.36 125.06,11.36 125.1,11.4
  Bottom 0.305: v139,2.3 139.1,2.4 144.4,2.4 147.41,5.41 147.41,15.89 145.7,17.6 140.17,17.6 v139.1,16.53
  Bottom 0.406: v62.5,2.3 64,2.3 64.9,3.2 66.3,3.2 67.6,1.9 103.9,1.9 104.8,2.8 v104.8,18.1 106.8,20.1 117.9,20.1 120.3,17.7 120.3,12.2 122,10.5 124.2,10.5 125.1,11.4 126.05,12.35 126.05,14.55 129.6,18.1 137.53,18.1 v139.1,16.53

### Text on the board
bPlace: 4ROBOTS | Made by humans | CC-BY-SA 4.0 | Shay Shezifi (PLUM) | HOT / SURFACE | 1uO_c | MAIN BOARD | rev: 1.1 | ORIGINAL O_C BY MXMXMX